# EAGLE schematic PowerSupply (EAGLE 6.2)
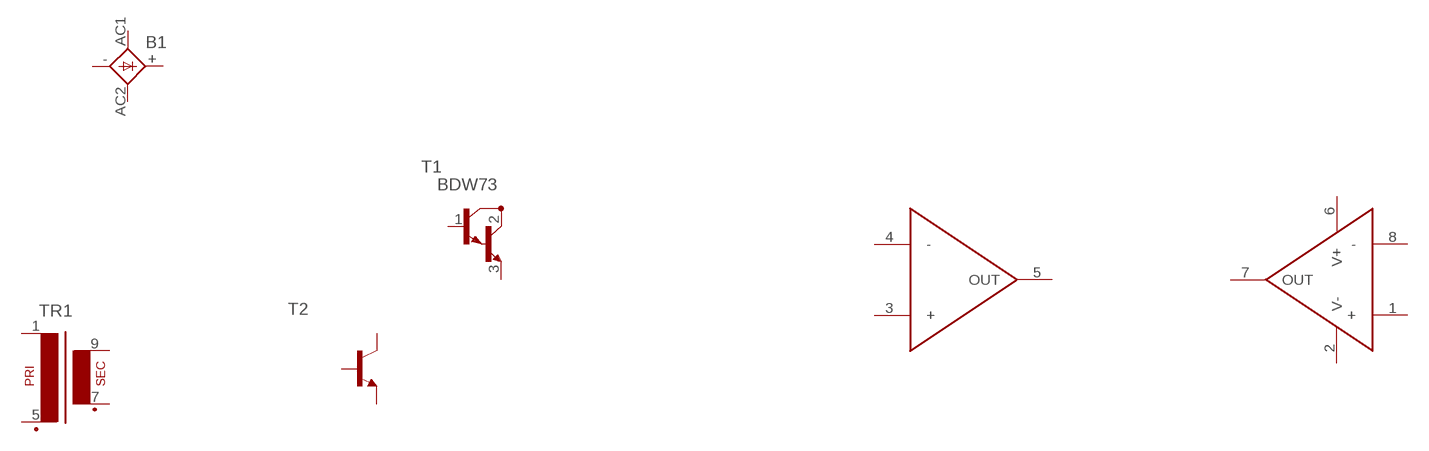
[diagram p0: schematic, sheet 1]

## Parts
B1  FB32  [FB32]
T1  BDW73  [TO220]
T2  2N3904-NPN-TO92-EBC  [TO92-EBC]
TR1  VV11  [VV11]
U$1  LT1013DS8  [SO08]
Unconnected: B1.+ B1.- B1.AC1 B1.AC2 T1.1(B) T1.2(C) T1.3(E) T2.B T2.C T2.E TR1.1 TR1.5(P2) TR1.7(S3) TR1.9(S4) U$1.1(+) U$1.2(V-) U$1.3(+) U$1.4(-) U$1.5(OUT) U$1.6(V+) U$1.7(OUT) U$1.8(-)

## Library data of the parts
B1 = rectifier:FB32: FAGOR RECTIFIER grid 1 x 10,2 x 7,5 mm
T1 = transistor:BDW73: NPN BIPOLAR DARLINGTON TRANSISTOR
T2 = transistor-neu-to92:*-NPN-: NPN Transistror
TR1 = trafo:VV11: TRANSFORMER 1 primary winding, 1 secondary winding BLOCK
U$1 = psu:LT1013DS8